# Altium schematic sheet ASP_SCH_SMD.SchDoc
size A
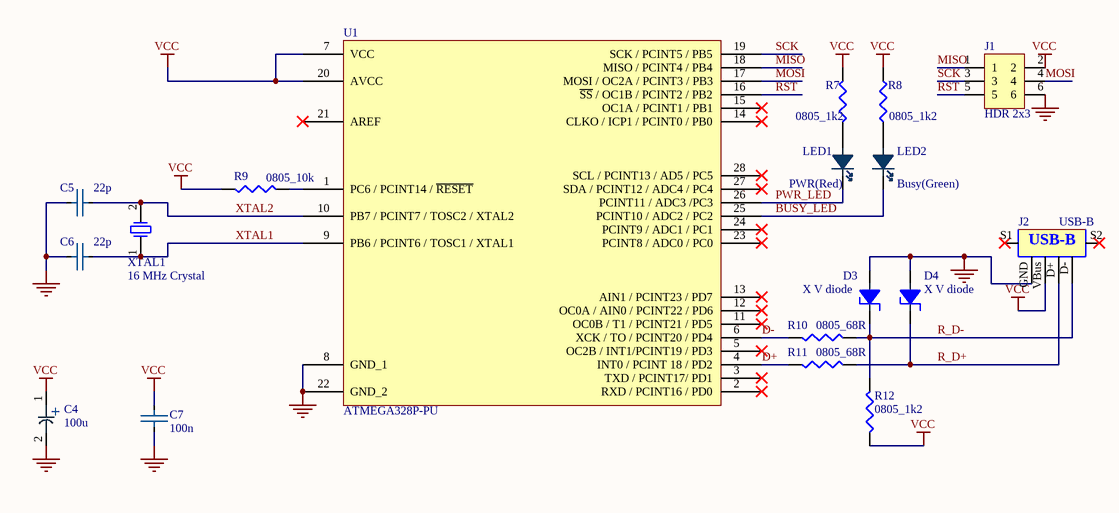
[diagram p0: ASP_SCH_SMD.SchDoc]

## Parts
C4  100u  [Capacitor]
C5  22p  [C0805 - 0.1uf]
C6  22p  [C0805 - 0.1uf]
C7  100n  [C0805 - 0.1uf]
D3  X V diode  [ZENER DO-35]
D4  X V diode  [ZENER DO-35]
J1  HDR 2x3  [HDR 2x3 2.54mm_1]
J2  USB-B  [USB_B]
LED1  PWR(Red)  [0805_LED]
LED2  Busy(Green)  [0805_LED]
R7  0805_1k2  [R0805]
R8  0805_1k2  [R0805]
R9  0805_10k  [R0805]
R10  0805_68R  [R0805]
R11  0805_68R  [R0805]
R12  0805_1k2  [R0805]
U1  ATMEGA328P-PU  [28_DIP_7.62mm_1]
XTAL1  16 MHz Crystal  [TH_CRYSTAL]

## Nets
GND: C4.2(Cathode) C5.1 C6.1 C7.1 D3.A(Anode) D4.A(Anode) J1.6 J2.GND U1.8(GND_1) U1.22(GND_2)
VCC: C4.1(Anode) C7.2 J1.2 J2.VBus R7.2 R8.2 R9.1 R12.1 U1.7(VCC) U1.20(AVCC)
BUSY_LED: LED2.2(Cathode) U1.25(PCINT10_/_ADC2_/_PC2)
D+: R11.1 U1.4(INT0_/_PCINT_18_/_PD2)
D-: R10.1 U1.6(XCK_/_TO_/_PCINT20_/_PD4)
MISO: J1.1 U1.18(MISO_/_PCINT4_/_PB4)
MOSI: J1.4 U1.17(MOSI_/_OC2A_/_PCINT3_/_PB3)
PWR_LED: LED1.2(Cathode) U1.26(PCINT11_/_ADC3_/PC3)
R_D+: D4.C(Cathode) J2.D+ R11.2
R_D-: D3.C(Cathode) J2.D- R10.2 R12.2
RST: J1.5 U1.16(~{SS}_/_OC1B_/_PCINT2_/_PB2)
SCK: J1.3 U1.19(SCK_/_PCINT5_/_PB5)
XTAL1: C6.2 U1.9(PB6_/_PCINT6_/_TOSC1_/_XTAL1) XTAL1.1
XTAL2: C5.2 U1.10(PB7_/_PCINT7_/_TOSC2_/_XTAL2) XTAL1.2
NetLED1_1: LED1.1(Anode) R7.1
NetLED2_1: LED2.1(Anode) R8.1
NetR9_2: R9.2 U1.1(PC6_/_PCINT14_/_~{RESET})

Not connected (* = marked no-connect by the designer): J2 S1* S2*; U1 2(RXD_/_PCINT16_/_PD0)* 3(TXD_/_PCINT17/_PD1)* 5(OC2B_/_INT1/PCINT19_/_PD3)* 11(OC0B_/_T1_/_PCINT21_/_PD5)* 12(OC0A_/_AIN0_/_PCINT22_/_PD6)* 13(AIN1_/_PCINT23_/_PD7)* 14(CLKO_/_ICP1_/_PCINT0_/_PB0)* 15(OC1A_/_PCINT1_/_PB1)* 21(AREF)* 23(PCINT8_/_ADC0_/_PC0)* 24(PCINT9_/_ADC1_/_PC1)* 27(SDA_/_PCINT12_/_ADC4_/_PC4)* 28(SCL_/_PCINT13_/_AD5_/_PC5)*

## Notes on the sheet
- (in symbol Electrolytic Cap) +

## Library data of the parts
C4 = Electrolytic Cap: General Symbol For Electrolytic Caps; Manufacturer 1: Nichicon; Manufacturer Part Number 1: UVP1H220MPD1TD; Dielectric Material: Aluminium; Ripple Current: 89mA; Life (Hours): 2000Hour; Voltage Rating (DC): 50V; Dissipation Factor: 0.14%; Capacitance: 22uF; Tolerance: 20%; Lead/Base Style: Straight; Supplier 1: Digi-Key; Stock 1: 3795; Pricing 1: 1=0.45000, 10=0.31100, 50=0.21780, 100=0.18660, 500=0.13998 (USD); RoHS: Yes; Mount: Through Hole; Case/Package: Radial; Number of Pins: 2; Min Operating Temperature: -40°C; Max Operating Temperature: 85°C; Package Quantity: 1000; Termination: Radial; Voltage Rating: 50V; Packaging: Tape and Reel; Diameter: 8mm; Length: 11.5mm; Height: 11.5mm; Lead Pitch: 3.5mm; Height - Seated (Max): 0.512inch; REACH SVHC: No SVHC; ComponentLink1URL: https://datasheet.ciiva.com/7781/e-vp-7781720.pdf?src-supplier=Element14; ComponentLink1Description: https://datasheet.ciiva.com/7781/e-vp-7781720.pdf?src-supplier=Element14; Supplier Part Number 1: 493-12700-1-ND
C5-C7 = C2012X5R1E105K125AA: TDK - C2012X5R1E105K125AA - SMD Multilayer Ceramic Capacitor, 1 µF, 25 V, 0805 [2012 Metric], ± 10%, X5R, C Series; Capacitance: 1uF; Voltage Rating: 25V; Parameter Name 1: Tape and Reel; Supplier 1: Digi-Key; Manufacturer 1: TDK; Manufacturer Part Number 1: C2012X5R1E105K125AA; Stock 1: 16168; Pricing 1: 1=0.23000, 10=0.15800, 50=0.09500, 100=0.08030, 500=0.05492, 1000=0.04858 (USD); RoHS: Yes; Mount: Surface Mount; Case/Package: 0805; Number of Pins: 2; Weight: 0.000194oz; Case Code (Metric): 2012; Case Code (Imperial): 0805; Dielectric Material: Ceramic; Min Operating Temperature: -55°C; Max Operating Temperature: 85°C; Voltage Rating (DC): 25V; Termination: SMD/SMT; Dielectric: X5R; Tolerance: 10%; Package Quantity: 2000; Resistor Type: Ceramic; Voltage: 25V; Length: 2mm; Height: 1.25mm; Depth: 1.25mm; Width: 0.049inch; Thickness: 0.057inch; Radiation Hardening: No; Lead Free: Lead Free; REACH SVHC: No SVHC; ComponentLink1URL: https://datasheet.ciiva.com/11787/0900766b80c1bb00-11787608.pdf?src-supplier=RSComponents; ComponentLink1Description: https://datasheet.ciiva.com/11787/0900766b80c1bb00-11787608.pdf?src-supplier=RSComponents; ComponentLink2URL: https://datasheet.ciiva.com/16449/e412-c-16449595.pdf?src-supplier=Future+Electronics; ComponentLink2Description: https://datasheet.ciiva.com/16449/e412-c-16449595.pdf?src-supplier=Future+Electronics; ComponentLink3URL: https://datasheet.ciiva.com/28602/1744655-28602171.pdf?src-supplier=Element14; ComponentLink3Description: https://datasheet.ciiva.com/28602/1744655-28602171.pdf?src-supplier=Element14; ComponentLink4URL: https://datasheet.ciiva.com/15192/getdatasheetpartid-726707-15192140.pdf?src-supplier=Verical; ComponentLink4Description: https://datasheet.ciiva.com/15192/getdatasheetpartid-726707-15192140.pdf?src-supplier=Verical; Supplier Part Number 1: 445-1419-1-ND
D3 D4 = Zener: Generic Zener Diode
J1 = HDR 2x3: CONN HEADER 6POS .100 STR 30AU; Manufacturer 1: Amphenol FCI; Manufacturer Part Number 1: 67997-106HLF; Number of Contacts: 6; Insulation Resistance: 5GR; Max Voltage Rating (AC): 1.5kV; Gender: Male; Parameter Name 1: Bulk; Current Rating: 3A; Connector Type: Male Pin; Pitch: 2.54mm; Row Spacing: 0.1inch; Contact Post Length: 3.05mm; Supplier 1: Digi-Key; Stock 1: 1359; Pricing 1: 1=1.78000, 10=1.61400, 100=1.38370, 500=1.15308, 1000=0.98835, 5000=0.87634, 10000=0.85657 (USD); RoHS: Yes; Mount: Through Hole; Contact Plating: Gold,GXT; Housing Color: Black; Contact Material: Bronze; Color: Black; Housing Material: Thermoplastic; Min Operating Temperature: -65°C; Max Operating Temperature: 125°C; Termination: Through Hole; Number of Rows: 2; Orientation: Straight; Number of Positions: 6; Package Quantity: 100; Contact Gender: Male; Voltage Rating: 1.5kV; Length: 7.62mm; Contact Mating Length: 0.23inch; Depth: 4.83mm; Radiation Hardening: No; Lead Free: Lead Free; REACH SVHC: No SVHC; Flammability Rating: UL94 V-0; ComponentLink1URL: https://datasheet.ciiva.com/5153/67996-222463-5153820.pdf?src-supplier=Mouser; ComponentLink1Description: https://datasheet.ciiva.com/5153/67996-222463-5153820.pdf?src-supplier=Mouser; ComponentLink2URL: https://datasheet.ciiva.com/16726/67996-16726286.pdf?src-supplier=Avnet+Europe; ComponentLink2Description: https://datasheet.ciiva.com/16726/67996-16726286.pdf?src-supplier=Avnet+Europe; ComponentLink3URL: https://datasheet.ciiva.com/722/67996-722044.pdf?src-supplier=Digi-Key; ComponentLink3Description: https://datasheet.ciiva.com/722/67996-722044.pdf?src-supplier=Digi-Key; ComponentLink4URL: https://datasheet.ciiva.com/10149/67996-10149221.pdf?src-supplier=Avnet; ComponentLink4Description: https://datasheet.ciiva.com/10149/67996-10149221.pdf?src-supplier=Avnet; ComponentLink5URL: https://datasheet.ciiva.com/46393/1876884-46393067.pdf?src-supplier=Element14; ComponentLink5Description: https://datasheet.ciiva.com/46393/1876884-46393067.pdf?src-supplier=Element14; Supplier Part Number 1: 609-3393-ND
J2 = USB-Type B: USB-Type B Female Connector
LED1 LED2 = 0805LED
R7-R12 = 0805 Resistor
U1 = ATMEGA328P-PU: ATMEGA328P-PU; 8 bit Microcontroller AVR 20MHz 1; 32kb Flash; 2kb RAM; I2C SPI 2; Manufacturer 1: Microchip / Atmel; Number of PWM Channels: 6; Number of Timers/Counters: 3; Min Supply Voltage: 1.8V; Max Supply Voltage: 5.5V; Interface: I2C,SPI,UART,USART,2-Wire; Number of I/Os: 23; Oscillator Type: Internal; Data Bus Width: 8b; Number of SPI Channels: 1; Watchdog Timer: Yes; Peripherals: Brown-out Detect/Reset,POR,PWM,WDT; Supplier 1: Digi-Key; Manufacturer Part Number 1: ATMEGA328P-PU; Stock 1: 7484; Pricing 1: 1=2.08000, 25=1.91000, 100=1.73000 (USD); RoHS: Yes; Mount: Through Hole; Case/Package: PDIP; Number of Pins: 28; Contact Plating: Tin,Matte; Min Operating Temperature: -40°C; Max Operating Temperature: 85°C; Package Quantity: 14; Core Architecture: AVR; RAM Size: 2KB; Number of ADC Channels: 6; Packaging: Rail/Tube; Frequency: 20MHz; Number of Programmable I/O: 23; Max Frequency: 20MHz; Number of I2C Channels: 1; Memory Type: FLASH; Memory Size: 32KB; Length: 37.4mm; Height: 3.28mm; Width: 6.76mm; Radiation Hardening: No; REACH SVHC: No SVHC; Lead Free: Lead Free; ComponentLink1URL: https://datasheet.ciiva.com/1157/1684409-1157696.pdf?src-supplier=Element14; ComponentLink1Description: https://datasheet.ciiva.com/1157/1684409-1157696.pdf?src-supplier=Element14; ComponentLink2URL: https://datasheet.ciiva.com/20168/73-4283-20168380.pdf?src-supplier=Rapid+Electronics; ComponentLink2Description: https://datasheet.ciiva.com/20168/73-4283-20168380.pdf?src-supplier=Rapid+Electronics; ComponentLink3URL: https://datasheet.ciiva.com/19457/2139111-19457070.pdf?src-supplier=Jameco; ComponentLink3Description: https://datasheet.ciiva.com/19457/2139111-19457070.pdf?src-supplier=Jameco; ComponentLink4URL: https://datasheet.ciiva.com/26818/atmega328p-pu-26818578.pdf?src-supplier=IIIC; ComponentLink4Description: https://datasheet.ciiva.com/26818/atmega328p-pu-26818578.pdf?src-supplier=IIIC; ComponentLink5URL: https://datasheet.ciiva.com/29119/155197-da-01-en-microcontr-atmega328p-pu-8bit-pdip-28-29119593.pdf?src-supplier=Conrad; ComponentLink5Description: https://datasheet.ciiva.com/29119/155197-da-01-en-microcontr-atmega328p-pu-8bit-pdip-28-29119593.pdf?src-supplier=Conrad; ComponentLink6URL: https://datasheet.ciiva.com/15213/getdatasheetpartid-318533-15213133.pdf?src-supplier=Verical; ComponentLink6Description: https://datasheet.ciiva.com/15213/getdatasheetpartid-318533-15213133.pdf?src-supplier=Verical; Supplier Part Number 1: ATMEGA328P-PU-ND
XTAL1 = Crystal